# Altium schematic sheet RasPi-BplusHAT.SchDoc
size 409 x 282 mm; >DRAWING_NAME: RasPi-BplusHAT.sch; >LAST_DATE_TIME: 08-Jan-17 10:29:30 AM; >SHEET: 1; Sheet:: Sheet:
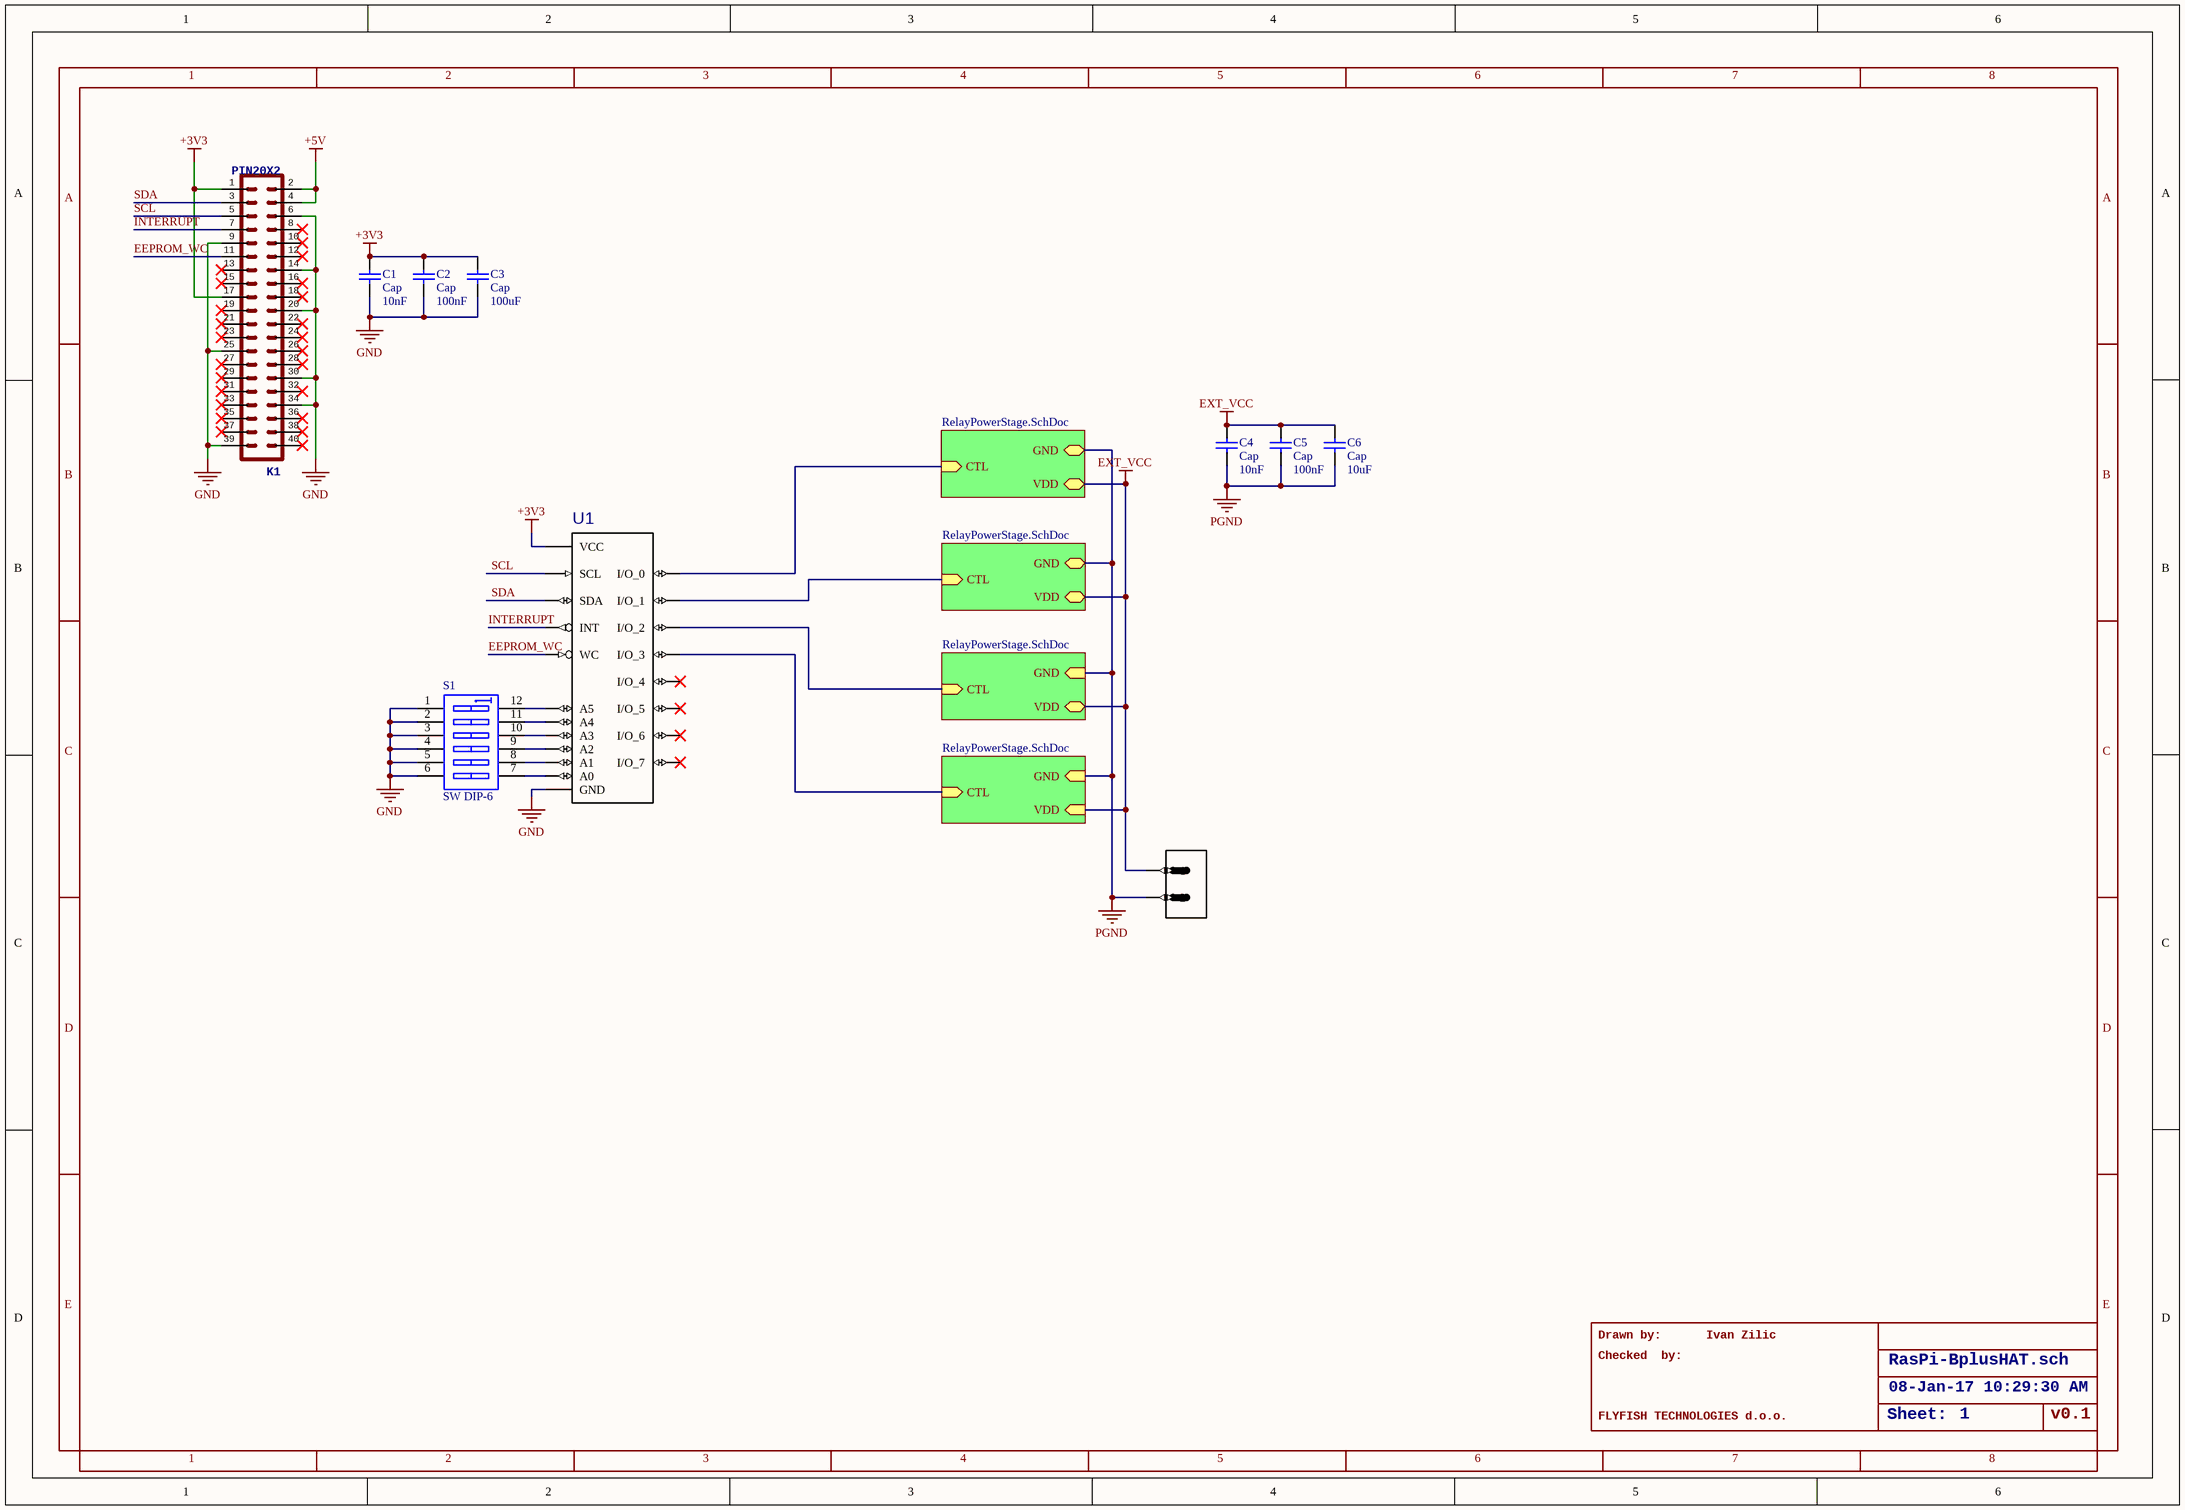
[diagram p0: RasPi-BplusHAT.SchDoc]

## Parts
C1  Cap  value 10nF  [6-0805_N]
C2  Cap  value 100nF  [6-0805_N]
C3  Cap  value 100uF  [6-0805_N]
C4  Cap  value 10nF  [6-0805_N]
C5  Cap  value 100nF  [6-0805_N]
C6  Cap  value 10uF  [C1210_N]
J1  1760510000  [1760490000]  (value not drawn)
K1  >NAME: K1  [HDR2X20]  (hidden comment: PIN20X2)
S1  SW DIP-6  [DIP-12/SW]
U1  PCA9501  [TSSOP20]  (value not drawn)

## Sub-sheets
RM = RelayPowerStage.SchDoc: VDD (bidir), GND (bidir), CTL (in)
RM = RelayPowerStage.SchDoc: VDD (bidir), GND (bidir), CTL (in)
RM = RelayPowerStage.SchDoc: VDD (bidir), GND (in), CTL (in)
RM = RelayPowerStage.SchDoc: VDD (in), GND (in), CTL (in)

## Nets
+3V3: C1.2 C2.2 C3.2 K1.1 K1.17 U1.20(VCC)
+5V: K1.2 K1.4
EXT_VCC: C4.2 C5.2 C6.2 J1.1 ; sheet RM/VDD, sheet RM/VDD, sheet RM/VDD, sheet RM/VDD
GND: C1.1 C2.1 C3.1 K1.6 K1.9 K1.14 K1.20 K1.25 K1.30 K1.34 K1.39 S1.1(A1) S1.2(A2) S1.3(A3) S1.4(A4) S1.5(A5) S1.6(A6) U1.10(GND)
PGND: C4.1 C5.1 C6.1 J1.2 ; sheet RM/GND, sheet RM/GND, sheet RM/GND, sheet RM/GND
EEPROM_WC: K1.11 U1.17(WC)
INTERRUPT: K1.7 U1.8(INT)
SCL: K1.5 U1.18(SCL)
SDA: K1.3 U1.19(SDA)
NetS1_7: S1.7(B6) U1.1(A0)
NetS1_8: S1.8(B5) U1.2(A1)
NetS1_9: S1.9(B4) U1.3(A2)
NetS1_10: S1.10(B3) U1.12(A3)
NetS1_11: S1.11(B2) U1.11(A4)
NetS1_12: S1.12(B1) U1.9(A5)
NetU1_4: U1.4(I/O_0) ; sheet RM/CTL
NetU1_5: U1.5(I/O_1) ; sheet RM/CTL
NetU1_6: U1.6(I/O_2) ; sheet RM/CTL
NetU1_7: U1.7(I/O_3) ; sheet RM/CTL

Not connected (* = marked no-connect by the designer): K1 8* 10* 12* 13* 15* 16* 18* 19* 21* 22* 23* 24* 26* 27* 28* 29* 31* 32* 33* 35* 36* 37* 38* 40*; U1 13(I/O_4)* 14(I/O_5)* 15(I/O_6)* 16(I/O_7)*

## Notes on the sheet
- Drawn by:
- Checked  by:
- Ivan Zilic
- FLYFISH TECHNOLOGIES d.o.o.
- v0.1
- 1
- 2
- 3
- 4
- 5
- 6
- 7
- 8
- A
- B
- C
- D
- E

## Library data of the parts
C1-C6 = Cap: Capacitor; Published: 8-Jun-2000; LatestRevisionDate: 17-Jul-2002; LatestRevisionNote: Re-released for DXP Platform.; PackageReference: RAD-0.3; Publisher: Altium Limited; PackageDescription: Radial Cap, Thru-Hole; 2 Leads; 0.3 in Pin Spacing
J1 = 1760510000: Conn Terminal Block 2 POS 5.08mm Solder ST Thru-Hole 16A; MF: Weidmuller; Package: None; MP: 1760510000; Price: 0.43 USD; Availability: Good; Value: *
S1 = SW DIP-6: DIP Switch, 6 Position, SPST; Published: 24-Mar-1999; LatestRevisionDate: 17-Jul-2002; LatestRevisionNote: Re-released for DXP Platform.; PackageReference: DIP-12/SW; Publisher: Altium Limited; PackageDescription: DIP Switch; 12 Leads
U1 = PCA9501: MF: NXP Semiconductors; MP: PCA9501; Package: None; Availability: Unavailable; Price: None; Value: *
K1 = PIN20X2: >VALUE: PIN20X2